# Altium schematic sheet CATS-EUROC-USB.SchDoc: CATS EuRoC Edition
size A4; DocumentNumber: Overview; Revision: V1.0; SheetNumber: 4; SheetTotal: 16; Author: Luca Jost; Subtitle: USB Connector
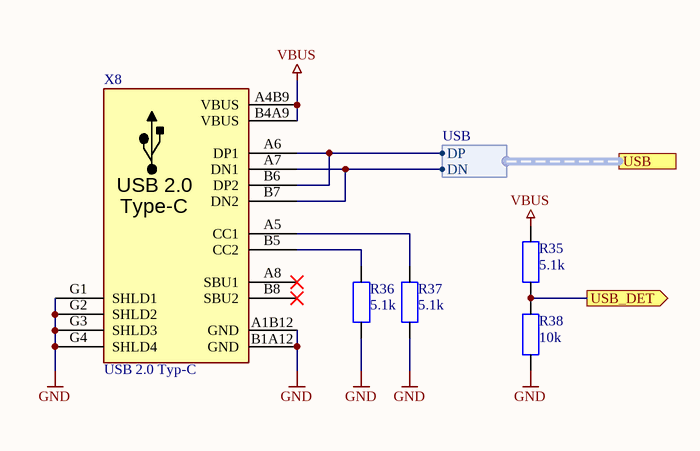
[diagram p0: CATS-EUROC-USB.SchDoc]

## Parts
R35  5.1k  [SMD Widerstand 0402]
R36  5.1k  [SMD Widerstand 0402]
R37  5.1k  [SMD Widerstand 0402]
R38  10k  [SMD Widerstand 0402]
X8  USB 2.0 Typ-C  [THT USB-C Socket (A40-00119)]

## Ports
USB (harness USB), USB_DET (out)

## Harnesses
USB: DP, DN

## Nets
GND: R36.1 R37.1 R38.2 X8.A1B12(GND) X8.B1A12(GND) X8.G1(SHLD1) X8.G2(SHLD2) X8.G3(SHLD3) X8.G4(SHLD4)
VBUS: R35.1 X8.A4B9(VBUS) X8.B4A9(VBUS)
USB_DET: R35.2 R38.1 ; port USB_DET
NetR36_2: R36.2 X8.B5(CC2)
NetR37_2: R37.2 X8.A5(CC1)
NetX8_A6: X8.A6(DP1) X8.B6(DP2) ; port USB.DP
NetX8_A7: X8.A7(DN1) X8.B7(DN2) ; port USB.DN

Not connected (* = marked no-connect by the designer): X8 A8(SBU1)* B8(SBU2)*

## Notes on the sheet
- Title
- Author:
- Subtitle
- Date:
- Rev:
- File:
- Sheet
- of
- (in symbol USB Type-C USB 2.0) USB 2.0; Type-C

## Library data of the parts
R35-R37 = E24 - 5.1k: SMD Chip Resistor E24; Unit Price: 0.01; Number: -; Supplier: -; JLC: C25905
R38 = E24 - 10k: SMD Chip Resistor E24; Unit Price: 0.01; Number: -; Supplier: -; JLC: C25744
X8 = USB Type-C USB 2.0: Typ-C; aliExpress: 33045191307; Digikey: 2073-USB4105-GF-ACT-ND; Farnell: 3583366; JLC: C167321